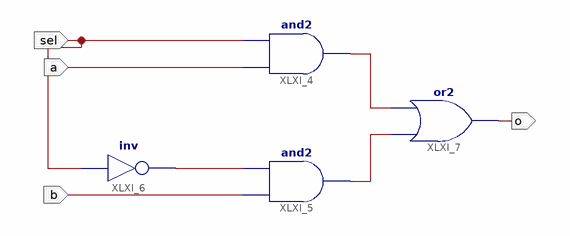
[diagram p0: schematic sheet 1]
// Xilinx ISE schematic mux2t1.sch (kintex7) as structural Verilog: 4 symbols, 4 ports
module mux2t1 (
  input  sel,
  input  a,
  input  b,
  output o
);

  wire XLXN_3, XLXN_6, XLXN_7;

  and XLXI_4 (XLXN_6, a, sel);
  and XLXI_5 (XLXN_7, b, XLXN_3);
  not XLXI_6 (XLXN_3, sel);
  or XLXI_7 (o, XLXN_7, XLXN_6);
endmodule
